# Altium schematic sheet Motor.SchDoc
size A2
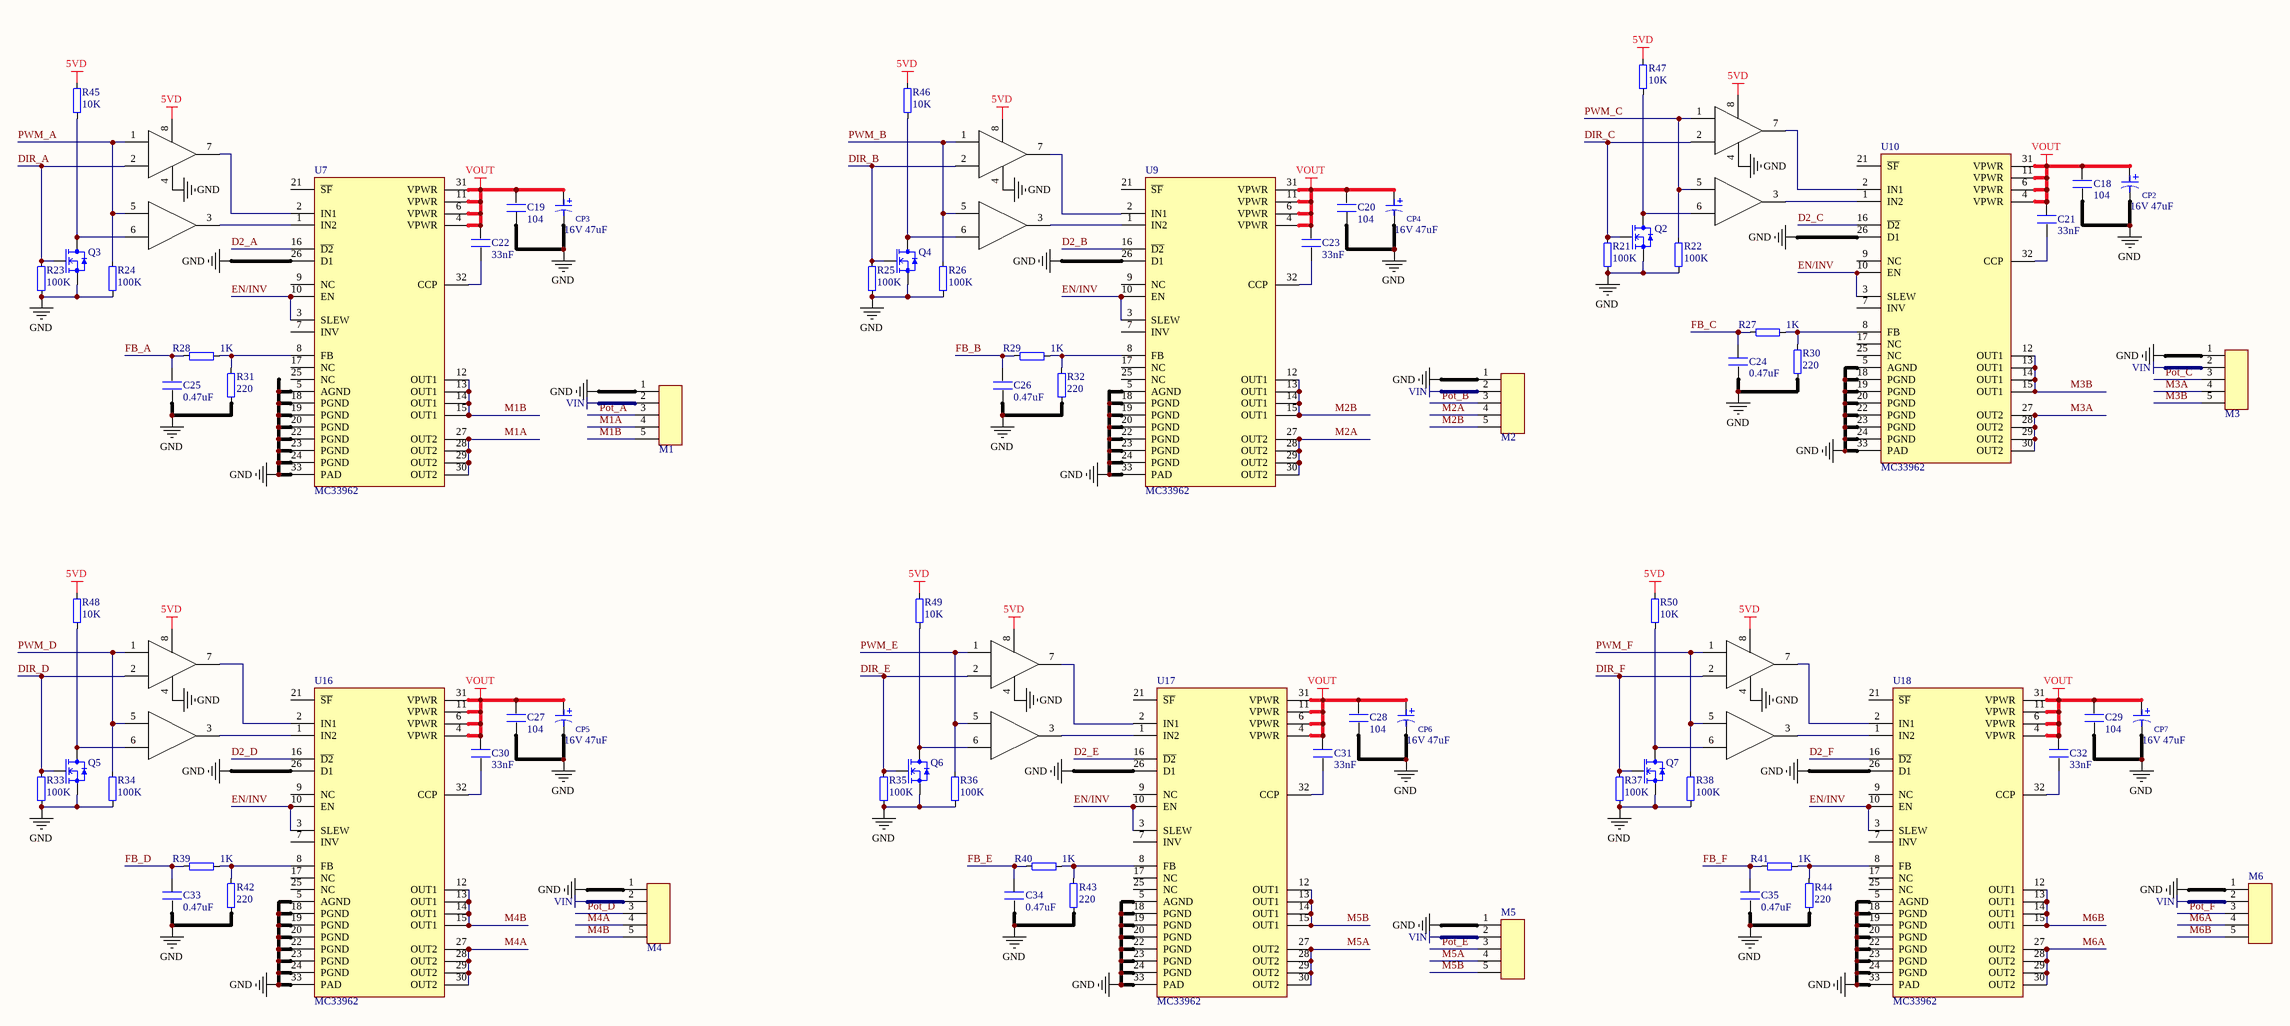
[diagram p0: Motor.SchDoc]

## Parts
C18  104  [SM0603C]
C19  104  [SM0603C]
C20  104  [SM0603C]
C21  33nF  [SM0603C]
C22  33nF  [SM0603C]
C23  33nF  [SM0603C]
C24  0.47uF  [SM0603C]
C25  0.47uF  [SM0603C]
C26  0.47uF  [SM0603C]
C27  104  [SM0603C]
C28  104  [SM0603C]
C29  104  [SM0603C]
C30  33nF  [SM0603C]
C31  33nF  [SM0603C]
C32  33nF  [SM0603C]
C33  0.47uF  [SM0603C]
C34  0.47uF  [SM0603C]
C35  0.47uF  [SM0603C]
CP2  16V 47uF  [SMD5-Al]
CP3  16V 47uF  [SMD5-Al]
CP4  16V 47uF  [SMD5-Al]
CP5  16V 47uF  [SMD5-Al]
CP6  16V 47uF  [SMD5-Al]
CP7  16V 47uF  [SMD5-Al]
M1  JC5  [FCI_SFW5R-1STE1LF]  (value not drawn)
M2  JC5  [FCI_SFW5R-1STE1LF]  (value not drawn)
M3  JC5  [FCI_SFW5R-1STE1LF]  (value not drawn)
M4  JC5  [FCI_SFW5R-1STE1LF]  (value not drawn)
M5  JC5  [FCI_SFW5R-1STE1LF]  (value not drawn)
M6  JC5  [FCI_SFW5R-1STE1LF]  (value not drawn)
Q2  2N7002  [SOT23-3]  (value not drawn)
Q3  2N7002  [SOT23-3]  (value not drawn)
Q4  2N7002  [SOT23-3]  (value not drawn)
Q5  2N7002  [SOT23-3]  (value not drawn)
Q6  2N7002  [SOT23-3]  (value not drawn)
Q7  2N7002  [SOT23-3]  (value not drawn)
R21  100K  [SM0603R]
R22  100K  [SM0603R]
R23  100K  [SM0603R]
R24  100K  [SM0603R]
R25  100K  [SM0603R]
R26  100K  [SM0603R]
R27  1K  [SM0603R]
R28  1K  [SM0603R]
R29  1K  [SM0603R]
R30  220  [SM0603R]
R31  220  [SM0603R]
R32  220  [SM0603R]
R33  100K  [SM0603R]
R34  100K  [SM0603R]
R35  100K  [SM0603R]
R36  100K  [SM0603R]
R37  100K  [SM0603R]
R38  100K  [SM0603R]
R39  1K  [SM0603R]
R40  1K  [SM0603R]
R41  1K  [SM0603R]
R42  220  [SM0603R]
R43  220  [SM0603R]
R44  220  [SM0603R]
R45  10K  [SM0603R]
R46  10K  [SM0603R]
R47  10K  [SM0603R]
R48  10K  [SM0603R]
R49  10K  [SM0603R]
R50  10K  [SM0603R]
U4  74XXX  [LC-VSSOP-8_2x2.3x05P]  (value not drawn)  (parts A,B of 2)
U5  74XXX  [LC-VSSOP-8_2x2.3x05P]  (value not drawn)  (parts A,B of 2)
U6  74XXX  [LC-VSSOP-8_2x2.3x05P]  (value not drawn)  (parts A,B of 2)
U7  MC33962  [PQFN32_0P8_8X8_SLUG]
U8  74XXX  [LC-VSSOP-8_2x2.3x05P]  (value not drawn)  (parts A,B of 2)
U9  MC33962  [PQFN32_0P8_8X8_SLUG]
U10  MC33962  [PQFN32_0P8_8X8_SLUG]
U11  74XXX  [LC-VSSOP-8_2x2.3x05P]  (value not drawn)  (parts A,B of 2)
U12  74XXX  [LC-VSSOP-8_2x2.3x05P]  (value not drawn)  (parts A,B of 2)
U16  MC33962  [PQFN32_0P8_8X8_SLUG]
U17  MC33962  [PQFN32_0P8_8X8_SLUG]
U18  MC33962  [PQFN32_0P8_8X8_SLUG]

## Nets
5VD: R45.2 R46.2 R47.2 R48.2 R49.2 R50.2 U4.8 U5.8 U6.8 U8.8 U11.8 U12.8
GND: C18.1 C19.1 C20.1 C24.2 C25.2 C26.2 C27.1 C28.1 C29.1 C33.2 C34.2 C35.2 CP2.2 CP3.2 CP4.2 CP5.2 CP6.2 CP7.2 M1.1 M2.1 M3.1 M4.1 M5.1 M6.1 Q2.2(S) Q3.2(S) Q4.2(S) Q5.2(S) Q6.2(S) Q7.2(S) R21.1 R22.1 R23.1 R24.1 R25.1 R26.1 R30.1 R31.1 R32.1 R33.1 R34.1 R35.1 R36.1 R37.1 R38.1 R42.1 R43.1 R44.1 U4.4 U5.4 U6.4 U7.5(AGND) U7.18(PGND) U7.19(PGND) U7.20(PGND) U7.22(PGND) U7.23(PGND) U7.24(PGND) U7.26(D1) U7.33(PAD) U8.4 U9.5(AGND) U9.18(PGND) U9.19(PGND) U9.20(PGND) U9.22(PGND) U9.23(PGND) U9.24(PGND) U9.26(D1) U9.33(PAD) U10.5(AGND) U10.18(PGND) U10.19(PGND) U10.20(PGND) U10.22(PGND) U10.23(PGND) U10.24(PGND) U10.26(D1) U10.33(PAD) U11.4 U12.4 U16.5(AGND) U16.18(PGND) U16.19(PGND) U16.20(PGND) U16.22(PGND) U16.23(PGND) U16.24(PGND) U16.26(D1) U16.33(PAD) U17.5(AGND) U17.18(PGND) U17.19(PGND) U17.20(PGND) U17.22(PGND) U17.23(PGND) U17.24(PGND) U17.26(D1) U17.33(PAD) U18.5(AGND) U18.18(PGND) U18.19(PGND) U18.20(PGND) U18.22(PGND) U18.23(PGND) U18.24(PGND) U18.26(D1) U18.33(PAD)
VIN: M1.2 M2.2 M3.2 M4.2 M5.2 M6.2
VOUT: C18.2 C19.2 C20.2 C21.1 C22.1 C23.1 C27.2 C28.2 C29.2 C30.1 C31.1 C32.1 CP2.1 CP3.1 CP4.1 CP5.1 CP6.1 CP7.1 U7.4(VPWR) U7.6(VPWR) U7.11(VPWR) U7.31(VPWR) U9.4(VPWR) U9.6(VPWR) U9.11(VPWR) U9.31(VPWR) U10.4(VPWR) U10.6(VPWR) U10.11(VPWR) U10.31(VPWR) U16.4(VPWR) U16.6(VPWR) U16.11(VPWR) U16.31(VPWR) U17.4(VPWR) U17.6(VPWR) U17.11(VPWR) U17.31(VPWR) U18.4(VPWR) U18.6(VPWR) U18.11(VPWR) U18.31(VPWR)
D2_A: U7.16(~{D2})
D2_B: U9.16(~{D2})
D2_C: U10.16(~{D2})
D2_D: U16.16(~{D2})
D2_E: U17.16(~{D2})
D2_F: U18.16(~{D2})
DIR_A: Q3.1(G) R23.2 U4.2
DIR_B: Q4.1(G) R25.2 U5.2
DIR_C: Q2.1(G) R21.2 U6.2
DIR_D: Q5.1(G) R33.2 U8.2
DIR_E: Q6.1(G) R35.2 U11.2
DIR_F: Q7.1(G) R37.2 U12.2
EN/INV: U7.3(SLEW) U7.10(EN) U9.3(SLEW) U9.10(EN) U10.3(SLEW) U10.10(EN) U16.3(SLEW) U16.10(EN) U17.3(SLEW) U17.10(EN) U18.3(SLEW) U18.10(EN)
FB_A: C25.1 R28.1
FB_B: C26.1 R29.1
FB_C: C24.1 R27.1
FB_D: C33.1 R39.1
FB_E: C34.1 R40.1
FB_F: C35.1 R41.1
M1A: M1.4 U7.27(OUT2) U7.28(OUT2) U7.29(OUT2) U7.30(OUT2)
M1B: M1.5 U7.12(OUT1) U7.13(OUT1) U7.14(OUT1) U7.15(OUT1)
M2A: M2.4 U9.27(OUT2) U9.28(OUT2) U9.29(OUT2) U9.30(OUT2)
M2B: M2.5 U9.12(OUT1) U9.13(OUT1) U9.14(OUT1) U9.15(OUT1)
M3A: M3.4 U10.27(OUT2) U10.28(OUT2) U10.29(OUT2) U10.30(OUT2)
M3B: M3.5 U10.12(OUT1) U10.13(OUT1) U10.14(OUT1) U10.15(OUT1)
M4A: M4.4 U16.27(OUT2) U16.28(OUT2) U16.29(OUT2) U16.30(OUT2)
M4B: M4.5 U16.12(OUT1) U16.13(OUT1) U16.14(OUT1) U16.15(OUT1)
M5A: M5.4 U17.27(OUT2) U17.28(OUT2) U17.29(OUT2) U17.30(OUT2)
M5B: M5.5 U17.12(OUT1) U17.13(OUT1) U17.14(OUT1) U17.15(OUT1)
M6A: M6.4 U18.27(OUT2) U18.28(OUT2) U18.29(OUT2) U18.30(OUT2)
M6B: M6.5 U18.12(OUT1) U18.13(OUT1) U18.14(OUT1) U18.15(OUT1)
Pot_A: M1.3
Pot_B: M2.3
Pot_C: M3.3
Pot_D: M4.3
Pot_E: M5.3
Pot_F: M6.3
PWM_A: R24.2 U4.1 U4.5
PWM_B: R26.2 U5.1 U5.5
PWM_C: R22.2 U6.1 U6.5
PWM_D: R34.2 U8.1 U8.5
PWM_E: R36.2 U11.1 U11.5
PWM_F: R38.2 U12.1 U12.5
NetC21_2: C21.2 U10.32(CCP)
NetC22_2: C22.2 U7.32(CCP)
NetC23_2: C23.2 U9.32(CCP)
NetC30_2: C30.2 U16.32(CCP)
NetC31_2: C31.2 U17.32(CCP)
NetC32_2: C32.2 U18.32(CCP)
NetQ2_3: Q2.3(D) R47.1 U6.6
NetQ3_3: Q3.3(D) R45.1 U4.6
NetQ4_3: Q4.3(D) R46.1 U5.6
NetQ5_3: Q5.3(D) R48.1 U8.6
NetQ6_3: Q6.3(D) R49.1 U11.6
NetQ7_3: Q7.3(D) R50.1 U12.6
NetR27_2: R27.2 R30.2 U10.8(FB)
NetR28_2: R28.2 R31.2 U7.8(FB)
NetR29_2: R29.2 R32.2 U9.8(FB)
NetR39_2: R39.2 R42.2 U16.8(FB)
NetR40_2: R40.2 R43.2 U17.8(FB)
NetR41_2: R41.2 R44.2 U18.8(FB)
NetU4_3: U4.3 U7.1(IN2)
NetU4_7: U4.7 U7.2(IN1)
NetU5_3: U5.3 U9.1(IN2)
NetU5_7: U5.7 U9.2(IN1)
NetU6_3: U6.3 U10.1(IN2)
NetU6_7: U6.7 U10.2(IN1)
NetU8_3: U8.3 U16.1(IN2)
NetU8_7: U8.7 U16.2(IN1)
NetU11_3: U11.3 U17.1(IN2)
NetU11_7: U11.7 U17.2(IN1)
NetU12_3: U12.3 U18.1(IN2)
NetU12_7: U12.7 U18.2(IN1)

Not connected (* = marked no-connect by the designer): U7 7(INV) 9(NC) 17(NC) 21(~{SF}) 25(NC); U9 7(INV) 9(NC) 17(NC) 21(~{SF}) 25(NC); U10 7(INV) 9(NC) 17(NC) 21(~{SF}) 25(NC); U16 7(INV) 9(NC) 17(NC) 21(~{SF}) 25(NC); U17 7(INV) 9(NC) 17(NC) 21(~{SF}) 25(NC); U18 7(INV) 9(NC) 17(NC) 21(~{SF}) 25(NC)

## Library data of the parts
C18-C35 = C
CP2-CP7 = 2.1.2.50.5162200: Cap, 22uF, 20%, 16V; Manufactory: ALUMINUM; InstallMode: SMD; Install: *; Value: 16V 47uF
Q2-Q7 = 2.1.4.40.0270020: Mos/N, 2N7002, 7.5 OHM, 0.5A, SOT23-3, Supertex; Manufactory: Supertex inc.; Name: N-Channel Enhancement-Mode Vertical DMOS FETs; InstallMode: SMD; Install: *; Part Number: 2.1.4.40.0270020; Value: 2N7002; HelpURL: http://doc.digimagus.net/doc/4 极管类/40 贴片场效应管(N-Channel)/2.1.4.40.0270020(2N7002).pdf
R21-R50 = RES